# Altium schematic sheet IDCI_WifiNode_PWR.SchDoc: WifiNoder_PWR
size A4; Author: Luciano Lopez; CompanyName: UTN-FRBA; Revision: 1; SheetNumber: 2; SheetTotal: 5
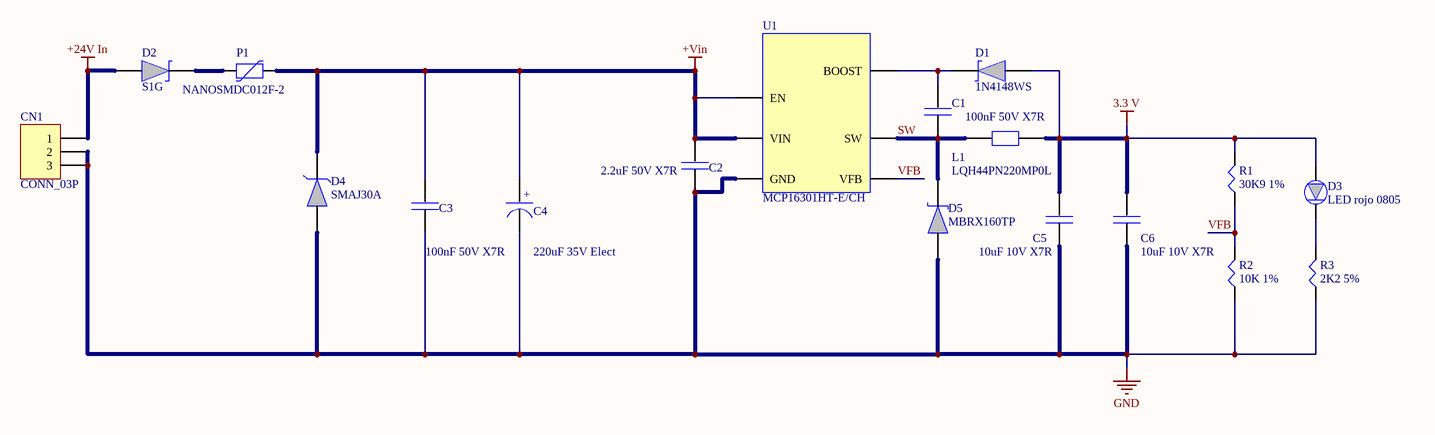
[diagram p0: IDCI_WifiNode_PWR.SchDoc]

## Parts
C1  100nF 50V X7R  [C_0805]
C2  2.2uF 50V X7R  [C_220ufx35V]
C3  100nF 50V X7R  [C_0805]
C4  220uF 35V Elect  [C_220ufx35V]
C5  10uF 10V X7R  [C_0805]
C6  10uF 10V X7R  [C_0805]
CN1  CONN_03P  [JACK_2.5mm_F]
D1  1N4148WS  [Diode_SOD-323]
D2  S1G  [DIODE_SMA]
D3  LED rojo 0805  [LED_0805]
D4  SMAJ30A  [DIODE_SMA]
D5  MBRX160TP  [Diode_SOD-123]
L1  LQH44PN220MP0L  [Inductor_4040]
P1  NANOSMDC012F-2  [Poly_1206]
R1  30K9 1%  [R_0805]
R2  10K 1%  [R_0805]
R3  2K2 5%  [R_0805]
U1  MCP16301HT-E/CH  [IC_SOT23-6]

## Nets
3.3 V: C5.1 C6.1 D1.1 D3.1 L1.2 R1.2
+24V In: CN1.1 D2.1
+Vin: C2.1 C3.1 C4.1 D4.2 P1.2 U1.4(EN) U1.5(VIN)
GND: C2.2 C3.2 C4.2 C5.2 C6.2 CN1.2 CN1.3 D4.1 D5.1 R2.1 R3.1 U1.2(GND)
SW: C1.2 D5.2 L1.1 U1.6(SW)
VFB: R1.1 R2.2 U1.3(VFB)
NetC1_1: C1.1 D1.2 U1.1(BOOST)
NetD2_2: D2.2 P1.1
NetD3_2: D3.2 R3.2

## Notes on the sheet
- Title:
- Size:
- Author:
- A4
- Sheet
- of
- Revision:
- File:
- Date:
- (in symbol POL_CAP) +

## Library data of the parts
C1-C3 C5 C6 = Capacitor: 100nF x 50v
C4 = POL_CAP: Capacitor polarizado
CN1 = CONN_03P: Connector Generic 3 Vias
D1 D2 D5 = TVS_DIODE
D3 = LED_DIODE
D4 = ZENER_DIODE
L1 = Inductor
P1 = Polyswitch
R1-R3 = Resistor
U1 = Integrado: Driver Switching